# Altium schematic sheet Sheet3.SchDoc: EM411-PROJ001
size A3; Date: March-25-2021; DrawnBy: Gaurav Daura; SheetNumber: 3; SheetTotal: 3
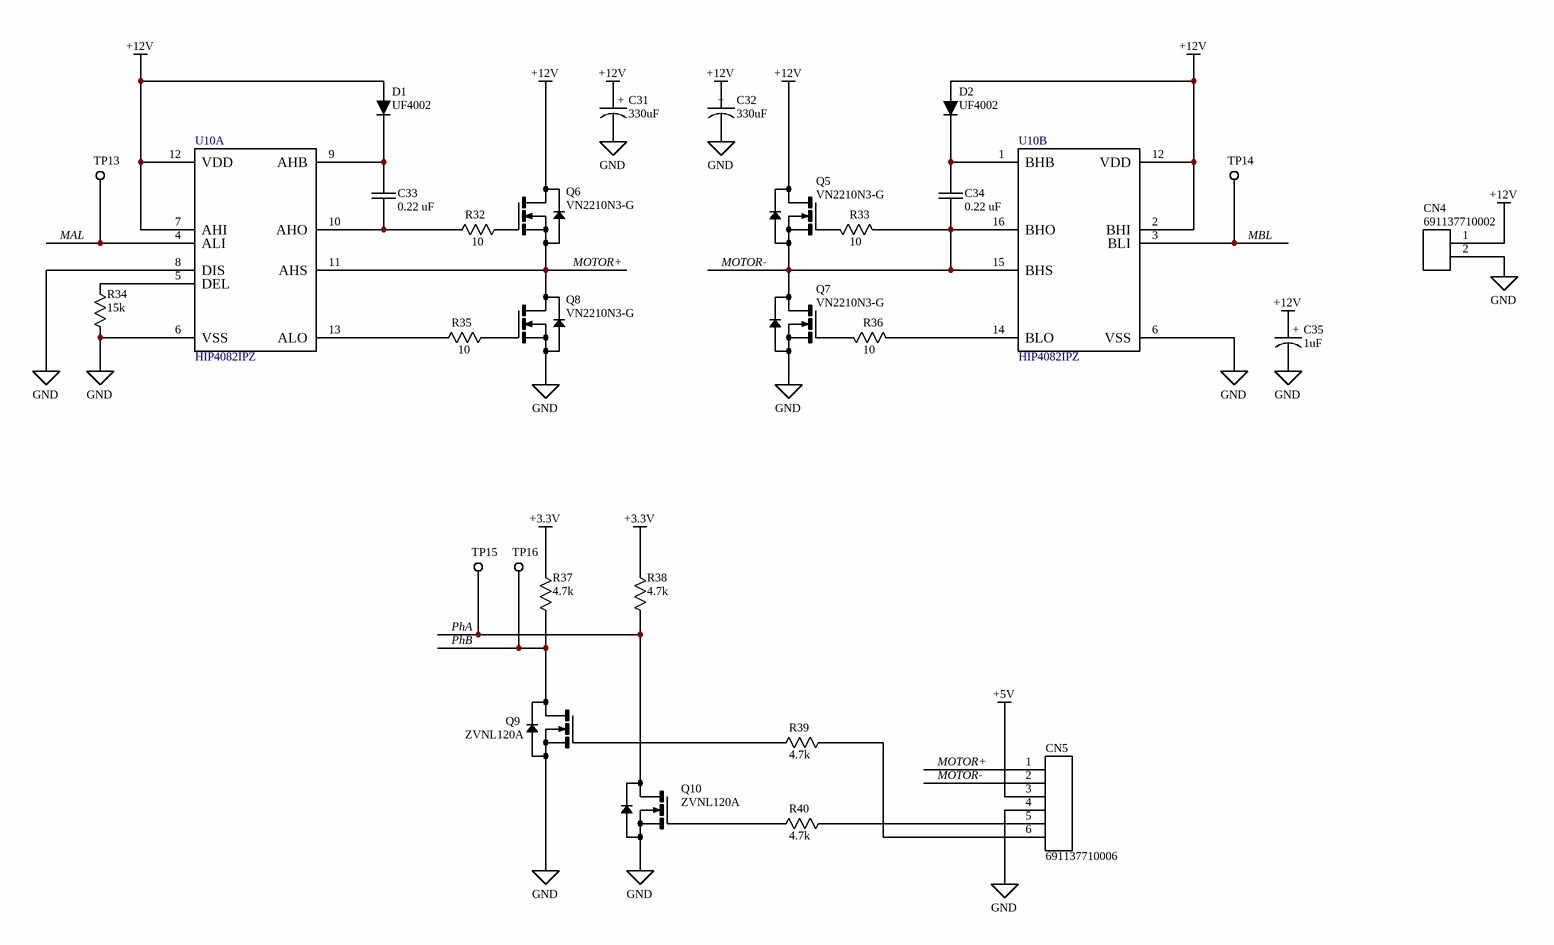
[diagram p0: Sheet3.SchDoc]

## Parts
C31  330uF  [ECA-1EM331]
C32  330uF  [ECA-1EM331]
C33  0.22 uF  [C330C224K1R5TA7301]
C34  0.22 uF  [C330C224K1R5TA7301]
C35  1uF  [SR215E105MAR]
CN4  691137710002  [691137710002]
CN5  691137710006  [691137710006]
D1  UF4002  [UF4002]
D2  UF4002  [UF4002]
Q5  VN2210N3-G  [VN2210N3-G]
Q6  VN2210N3-G  [VN2210N3-G]
Q7  VN2210N3-G  [VN2210N3-G]
Q8  VN2210N3-G  [VN2210N3-G]
Q9  ZVNL120A  [ZVNL120A]
Q10  ZVNL120A  [ZVNL120A]
R32  10  [1/2WattResistor]
R33  10  [1/2WattResistor]
R34  15k  [1/2WattResistor]
R35  10  [1/2WattResistor]
R36  10  [1/2WattResistor]
R37  4.7k  [1/2WattResistor]
R38  4.7k  [1/2WattResistor]
R39  4.7k  [1/2WattResistor]
R40  4.7k  [1/2WattResistor]
TP13  TESTPOINT-2MM  [TESTPOINT-2MM]  (value not drawn)  (no BOM)
TP14  TESTPOINT-2MM  [TESTPOINT-2MM]  (value not drawn)  (no BOM)
TP15  TESTPOINT-2MM  [TESTPOINT-2MM]  (value not drawn)  (no BOM)
TP16  TESTPOINT-2MM  [TESTPOINT-2MM]  (value not drawn)  (no BOM)
U10  HIP4082IPZ  [HIP4082IPZ]  (parts A,B of 2)

## Nets
+3.3V: R37.2 R38.2
+5V: CN5.3
+12V: C31.1 C32.1 C35.1 CN4.1 D1.A D2.A Q5.3 Q6.3 U10.2(BHI) U10.7(AHI) U10.12(VDD)
GND: C31.2 C32.2 C35.2 CN4.2 CN5.4 Q7.1 Q8.1 Q9.1 Q10.1 R34.1 U10.6(VSS) U10.8(DIS)
MAL: TP13.1 U10.4(ALI)
MBL: TP14.1 U10.3(BLI)
MOTOR+: CN5.1 Q6.1 Q8.3 U10.11(AHS)
MOTOR-: C34.2 CN5.2 Q5.1 Q7.3 R33.1 U10.15(BHS) U10.16(BHO)
PhA: Q10.3 R38.1 TP15.1
PhB: Q9.3 R37.1 TP16.1
NetC33_1: C33.1 D1.K U10.9(AHB)
NetC33_2: C33.2 R32.1 U10.10(AHO)
NetC34_1: C34.1 D2.K U10.1(BHB)
NetCN5_5: CN5.5 R40.2
NetCN5_6: CN5.6 R39.2
NetQ5_2: Q5.2 R33.2
NetQ6_2: Q6.2 R32.2
NetQ7_2: Q7.2 R36.2
NetQ8_2: Q8.2 R35.2
NetQ9_2: Q9.2 R39.1
NetQ10_2: Q10.2 R40.1
NetR34_2: R34.2 U10.5(DEL)
NetR35_1: R35.1 U10.13(ALO)
NetR36_1: R36.1 U10.14(BLO)

## Notes on the sheet
- Course
- EM 411 Embedded Systems Design
- Title
- Date
- Sheet
- of
- File
- Drawn by
- (in symbol ECA-1EM331) +
- (in symbol SR215E105MAR) +

## Library data of the parts
C31 C32 = ECA-1EM331: 330 uF, 25 V Aluminum Electrolytic Capacitor; Manufacturer: Panasonic Corporation of North America; PartNumber: ECA-1EM331
C33 C34 = C330C224K1R5TA7301: 0.22 uF, 100 V Ceramic Capacitor; Manufacturer: Kemet; PartNumber: C330C224K1R5TA7301
C35 = SR215E105MAR: 1 uF, 50 V Ceramic Capacitor; Manufacturer: AVX Corporation; PartNumber: SR215E105MAR
CN4 = 691137710002: TERM BLK 2POS SIDE ENTRY 5MM PCB; Manufacturer: Wurth Elektronk; PartNumber: 691137710002
CN5 = 691137710006: TERM BLK 6POS SIDE ENTRY 5MM PCB; Manufacturer: Wurth Elektronik; PartNumber: 691137710006
D1 D2 = UF4002: Fast Rectifier; Manufacturer: ON Semiconductor; PartNumber: UF4002
Q5-Q8 = VN2210N3-G: N-Channel Enhancement-Mode Vertical DMOS FETs; Manufacturer: Supertex Inc.; PartNumber: VN2210N3-G
Q9 Q10 = ZVNL120A: 25V, 31 A, N-Channel Power MOSFET; Manufacturer: Diodes Inc; PartNumber: ZVNL120A
R32 R33 R35 R36 = RES10-500mW-THRU-HOLE: 10 Ohmn, ±5%, 0.5W Thru-Hole Resistor; Manufacturer: Generic; PartNumber: RES10-500mW-THRU-HOLE; Value: 10
R34 = RES15k-500mW-THRU-HOLE: 15 kOhm, ±5%, 0.5W Thru-Hole Resistor; Manufacturer: Generic; PartNumber: RES15k-500mW-THRU-HOLE; Value: 15k
R37-R40 = RES4k7-500mW-THRU-HOLE: 4.7 kOhm, ±5%, 0.5W Thru-Hole Resistor; Manufacturer: Generic; PartNumber: RES4k7-500mW-THRU-HOLE; Value: 4.7k
TP13-TP16 = TESTPOINT-2MM: Test Point 2MM diameter; Manufacturer: -; PartNumber: -
U10 = HIP4082IPZ: 80V, 1.25A Peak Current H-Bridge FET Driver; Manufacturer: Renesas; PartNumber: HIP4082IPZ